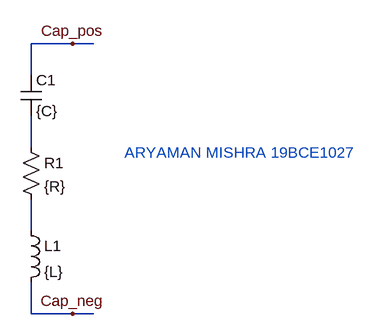
[diagram p0: schematic my_cap.asc]
my_cap.asc, the LTspice schematic file:
Version 4
SHEET 1 880 680
WIRE 208 -16 144 -16
WIRE 240 -16 208 -16
WIRE 144 32 144 -16
WIRE 144 144 144 96
WIRE 144 272 144 224
WIRE 144 400 144 352
WIRE 208 400 144 400
WIRE 240 400 208 400
FLAG 208 -16 Cap_pos
FLAG 208 400 Cap_neg
SYMBOL cap 128 32 R0
SYMATTR InstName C1
SYMATTR Value {C}
SYMBOL res 128 128 R0
SYMATTR InstName R1
SYMATTR Value {R}
SYMBOL ind 128 256 R0
SYMATTR InstName L1
SYMATTR Value {L}
TEXT 288 152 Left 2 ;ARYAMAN MISHRA 19BCE1027

The netlist it stands for:
* my_cap.asc
C1 Cap_pos N001 {C}
R1 N001 N002 {R}
L1 N002 Cap_neg {L}
* ARYAMAN MISHRA 19BCE1027
.backanno
.end